# EasyEDA Pro project ProPrj_人体健康检测系统_2026-04-15.epro

# Schematic Schematic1
Assembly Variant: Basic; Board Name: Board1; Create Date: 2026-04-11; Page Name: P1; Project Name: 人体健康检测系统; Schematic Name: Schematic1; Update Date: 2026-04-11; BladeWidth: 10; Company: 嘉立创EDA; Page Size: A4; RegionStart: 1; ShowBorder: 1; TitleBlock: 1; TitleBlockPosition: 3; Version: V1.0; XRegionCount: 6; YRegionCount: 4
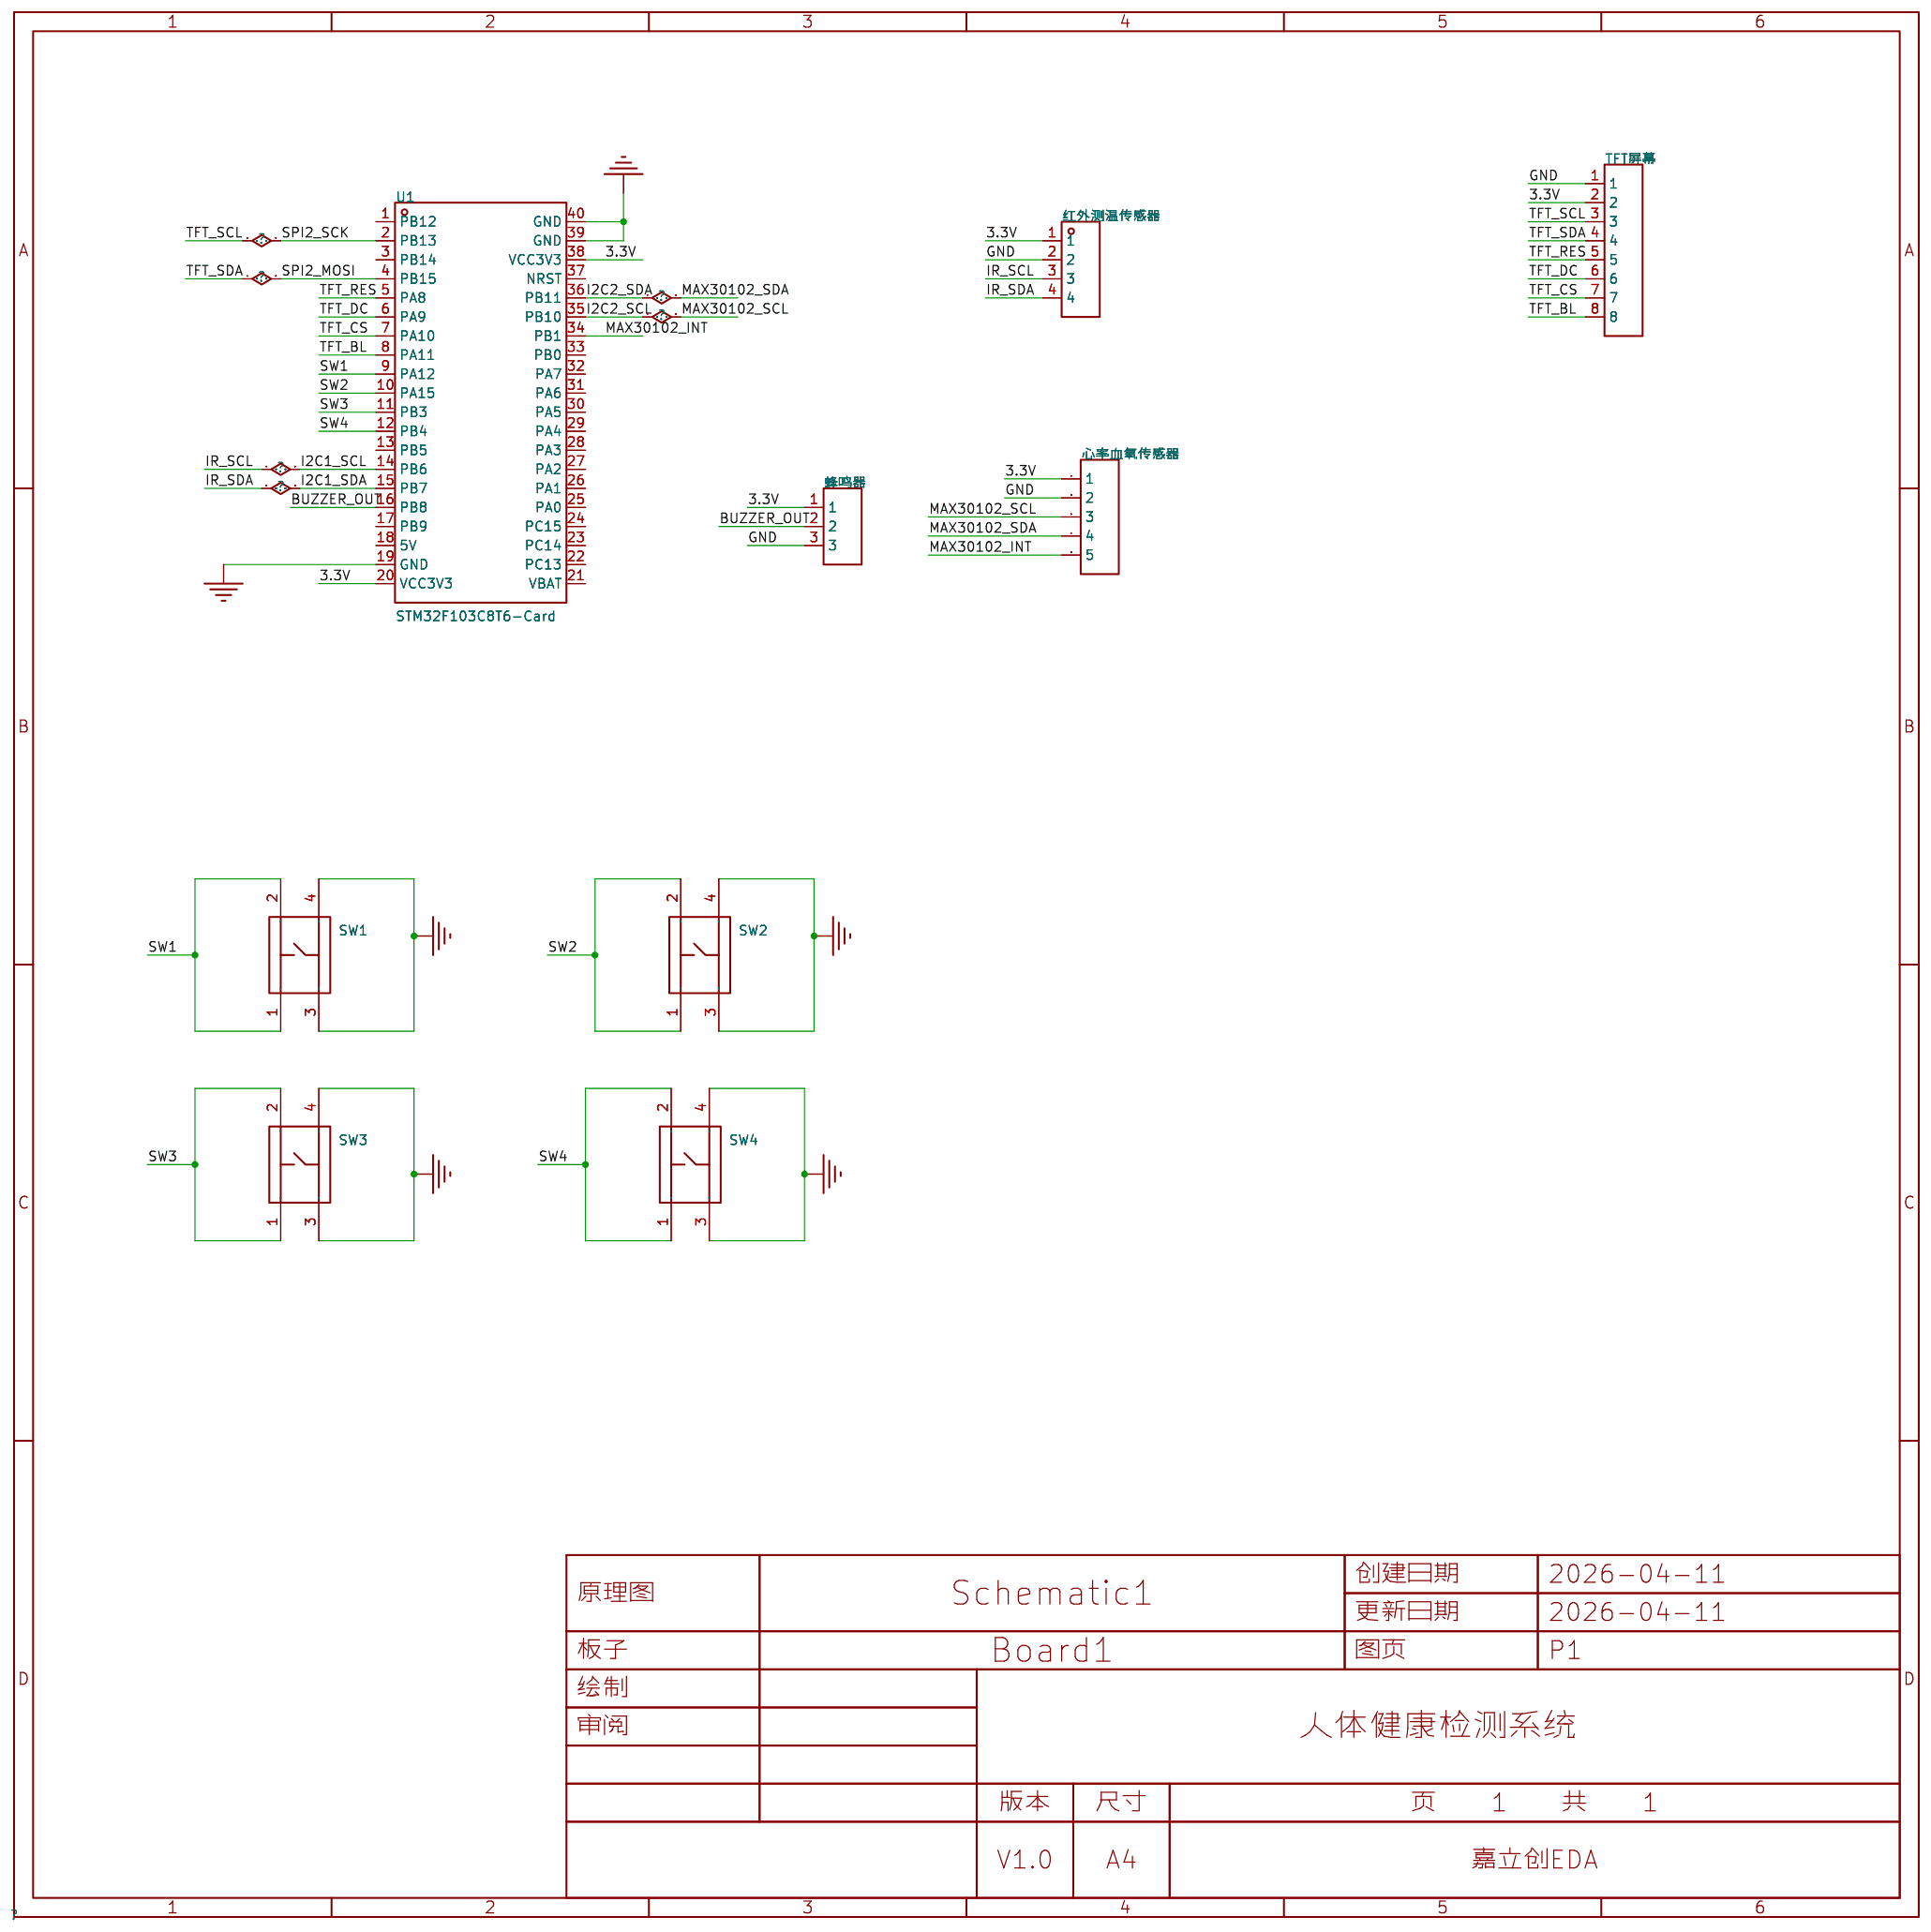
[diagram p0: schematic sheet]

## Parts
SW1  K2-1102DP-C4SW-04  [KEY-TH_4P-L6.0-W6.0-P4.50-LS6.50]
SW2  K2-1102DP-C4SW-04  [KEY-TH_4P-L6.0-W6.0-P4.50-LS6.50]
SW3  K2-1102DP-C4SW-04  [KEY-TH_4P-L6.0-W6.0-P4.50-LS6.50]
SW4  K2-1102DP-C4SW-04  [KEY-TH_4P-L6.0-W6.0-P4.50-LS6.50]
TFT屏幕  -  [HDR-TH_8P-P2.54-V-F-1]
U1  STM32F103C8T6-Card  [CONN-TH_L53.3-W22.9_STM32F103C8T6-CARD]
心率血氧传感器  -  [HDR-TH_5P-P2.54-V-F]
红外测温传感器  -  [HDR-TH_4P-P2.54-V-F]
蜂鸣器  -  [HDR-TH_3P-P2.54-V-F]

## Library data of the parts
SW1-SW4 = K2-1102DP-C4SW-04: 电路结构:单刀单掷;按钮形状:圆形按钮;作用力:2.5N;安装方式:直插;开关长度:6mm;开关宽度:6mm;开关高度:5mm;触点电流:50mA;额定电压:12V;带灯:-;工作寿命:10万次;; LCSC Part Name: 轻触按键开关6*6*5; Supplier Part: C110153; Manufacturer: 韩国韩荣; Supplier Footprint: 插件-4P,6x6mm; JLCPCB Part Class: Extended Part; Datasheet: https://item.szlcsc.com/datasheet/K2-1102DP-C4SW-04/111374.html; Supplier: LCSC; Circuit: 单刀单掷; Actuator Style: 圆形按钮; Operating Force: 2.5N; Mounting Type: 直插; Length: 6mm; Width: 6mm; Switch Height: 5mm; Contact Current: 50mA; Voltage Rating: 12V; Life: 10万次; Operating Temperature: -25℃~+85℃
TFT屏幕 = HDR-F_2.54_1x8P: Supplier Part: C27438; Supplier Footprint: 插件
U1 = STM32F103C8T6-Card: Supplier Part: C9900077949; Supplier Footprint: 插件; JLCPCB Part Class: Extended Part; Supplier: LCSC
心率血氧传感器 = HDR-F_2.54_1x5P: Supplier Part: C50950; Supplier Footprint: 插件
红外测温传感器 = HDR-F_2.54_1x4P: Supplier Part: C2718488; Supplier Footprint: 插件
蜂鸣器 = HDR-F_2.54_1x3P: Supplier Part: C541850; Supplier Footprint: 插件

## Nets
3.3V: TFT屏幕.2 U1.20(VCC3V3) U1.38(VCC3V3) 心率血氧传感器.1 红外测温传感器.1 蜂鸣器.1
GND: SW1.3 SW1.4 SW2.3 SW2.4 SW3.3 SW3.4 SW4.3 SW4.4 TFT屏幕.1 U1.19(GND) U1.39(GND) U1.40(GND) 心率血氧传感器.2 红外测温传感器.2 蜂鸣器.3
BUZZER_OUT: U1.16(PB8) 蜂鸣器.2
I2C1_SCL: U1.14(PB6) 红外测温传感器.3
I2C1_SDA: U1.15(PB7) 红外测温传感器.4
I2C2_SCL: U1.35(PB10) 心率血氧传感器.3
I2C2_SDA: U1.36(PB11) 心率血氧传感器.4
MAX30102_INT: U1.34(PB1) 心率血氧传感器.5
SPI2_MOSI: TFT屏幕.4 U1.4(PB15)
SPI2_SCK: TFT屏幕.3 U1.2(PB13)
SW1: SW1.1 SW1.2 U1.9(PA12)
SW2: SW2.1 SW2.2 U1.10(PA15)
SW3: SW3.1 SW3.2 U1.11(PB3)
SW4: SW4.1 SW4.2 U1.12(PB4)
TFT_BL: TFT屏幕.8 U1.8(PA11)
TFT_CS: TFT屏幕.7 U1.7(PA10)
TFT_DC: TFT屏幕.6 U1.6(PA9)
TFT_RES: TFT屏幕.5 U1.5(PA8)

Not connected (* = marked no-connect by the designer): U1 1(PB12) 3(PB14) 13(PB5) 17(PB9) 18(5V) 21(VBAT) 22(PC13) 23(PC14) 24(PC15) 25(PA0) 26(PA1) 27(PA2) 28(PA3) 29(PA4) 30(PA5) 31(PA6) 32(PA7) 33(PB0) 37(NRST)

# Board PCB1
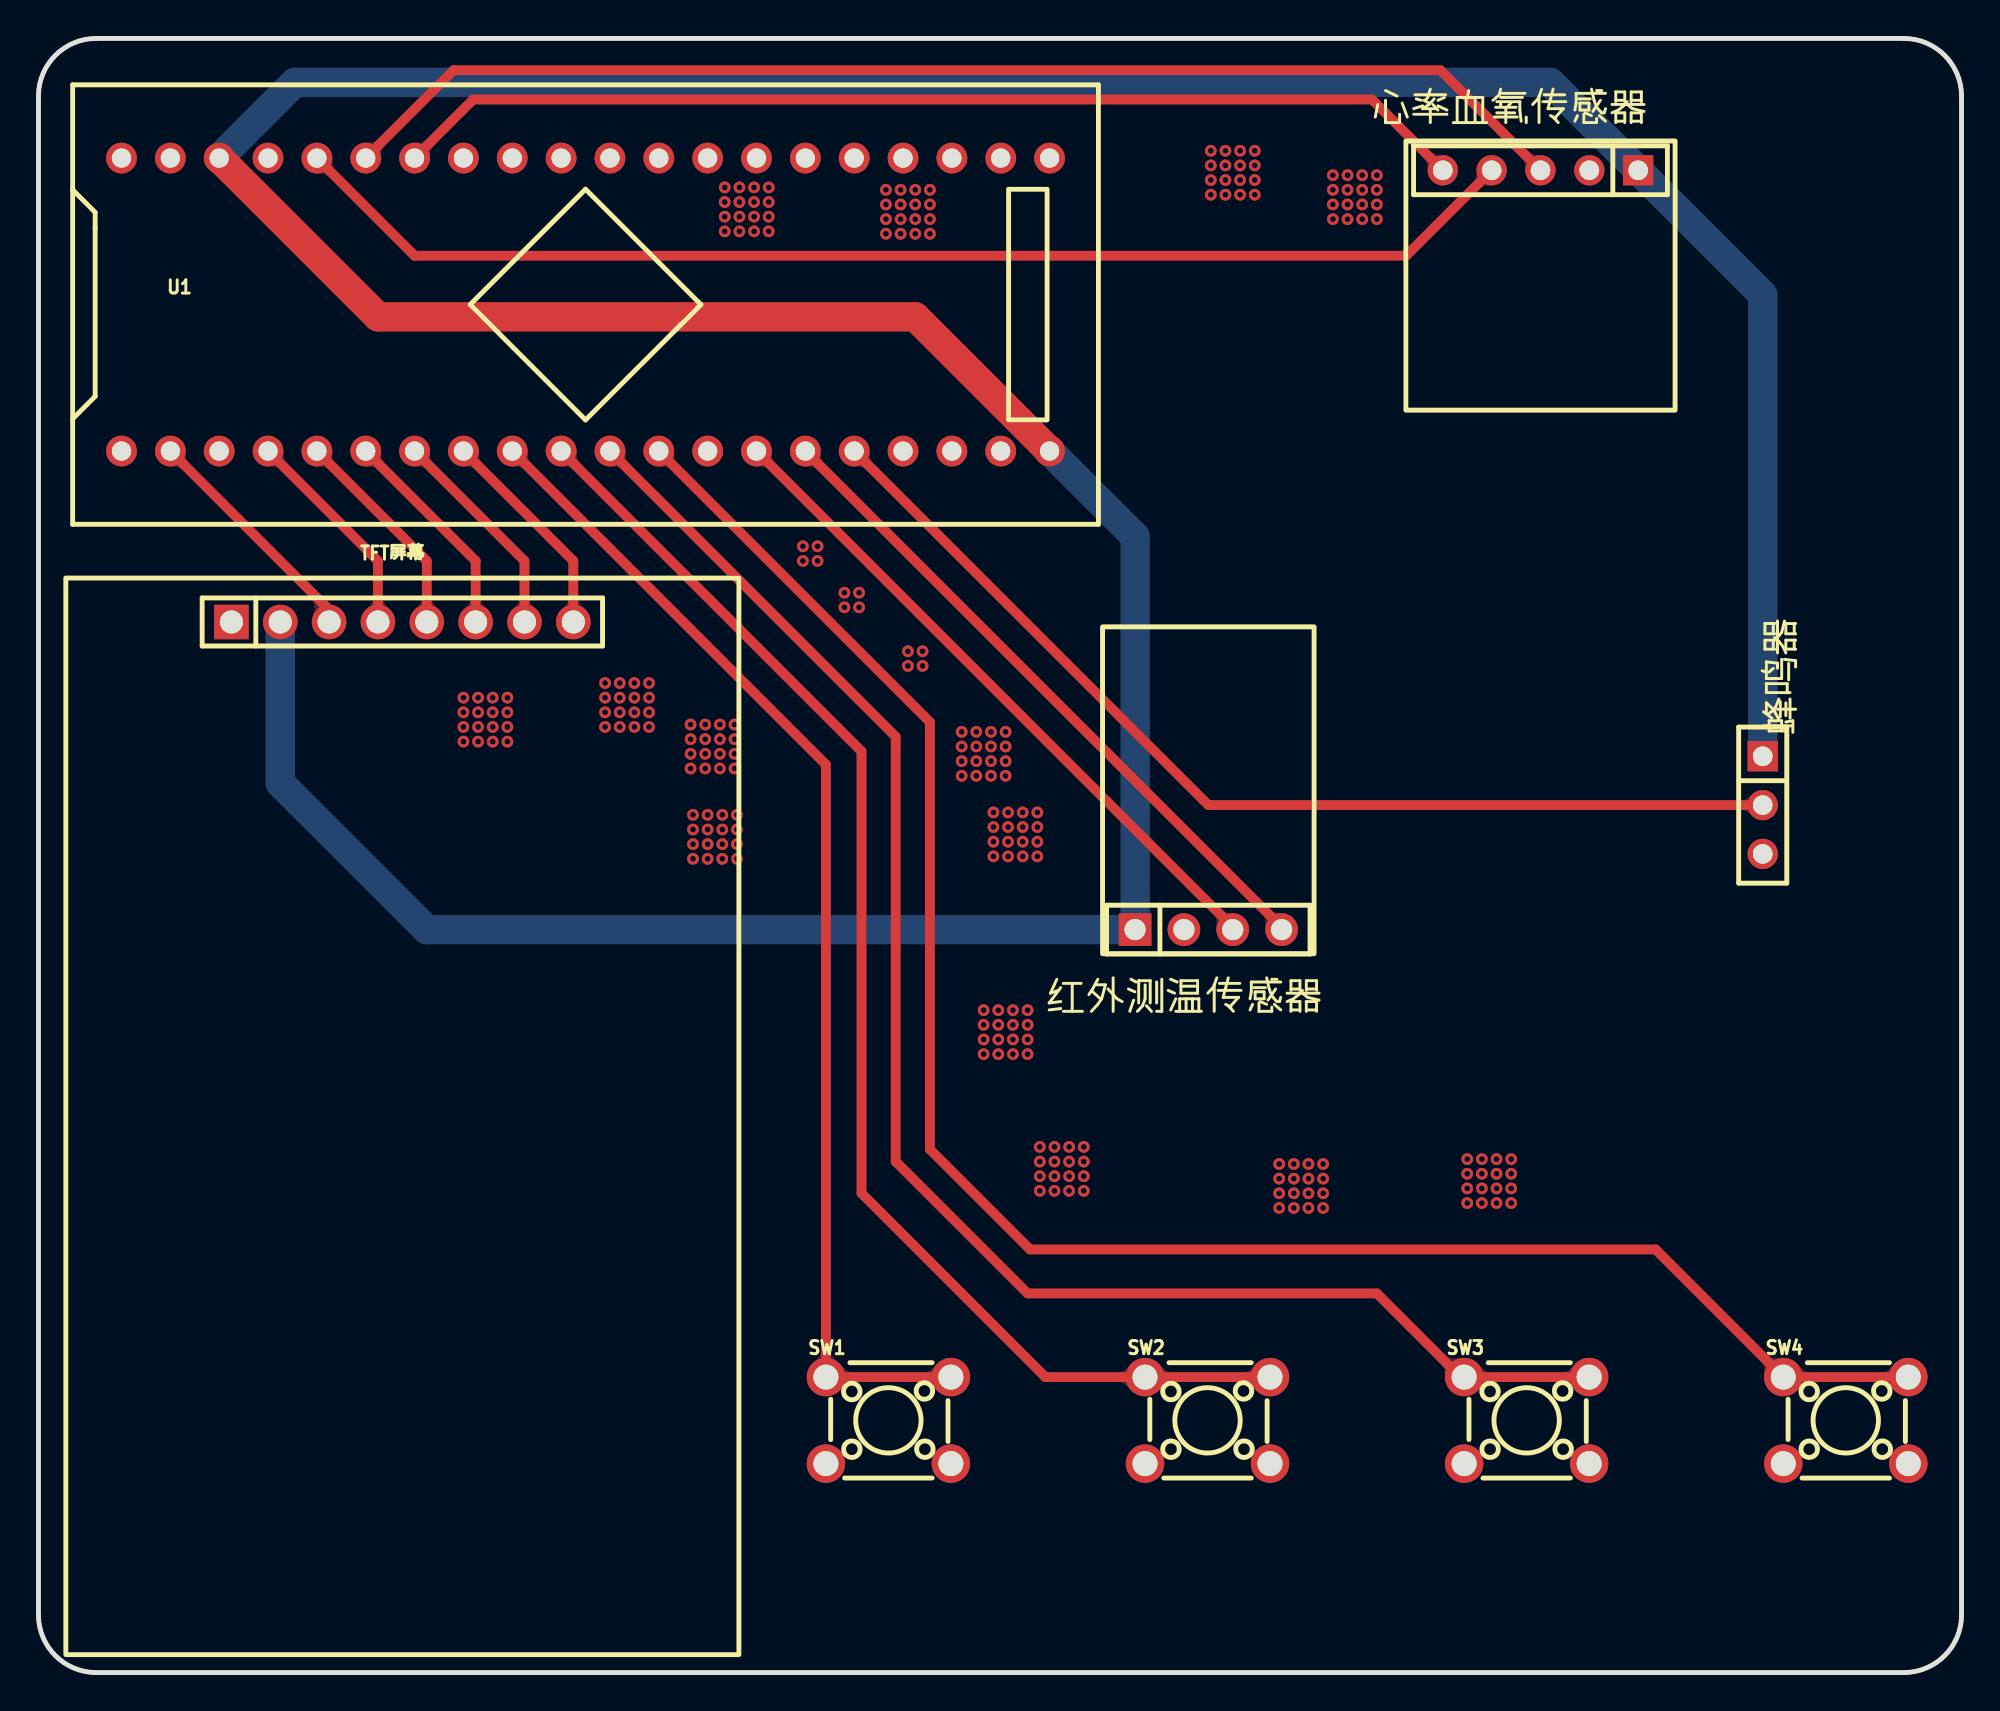
[diagram p1: board, top side]
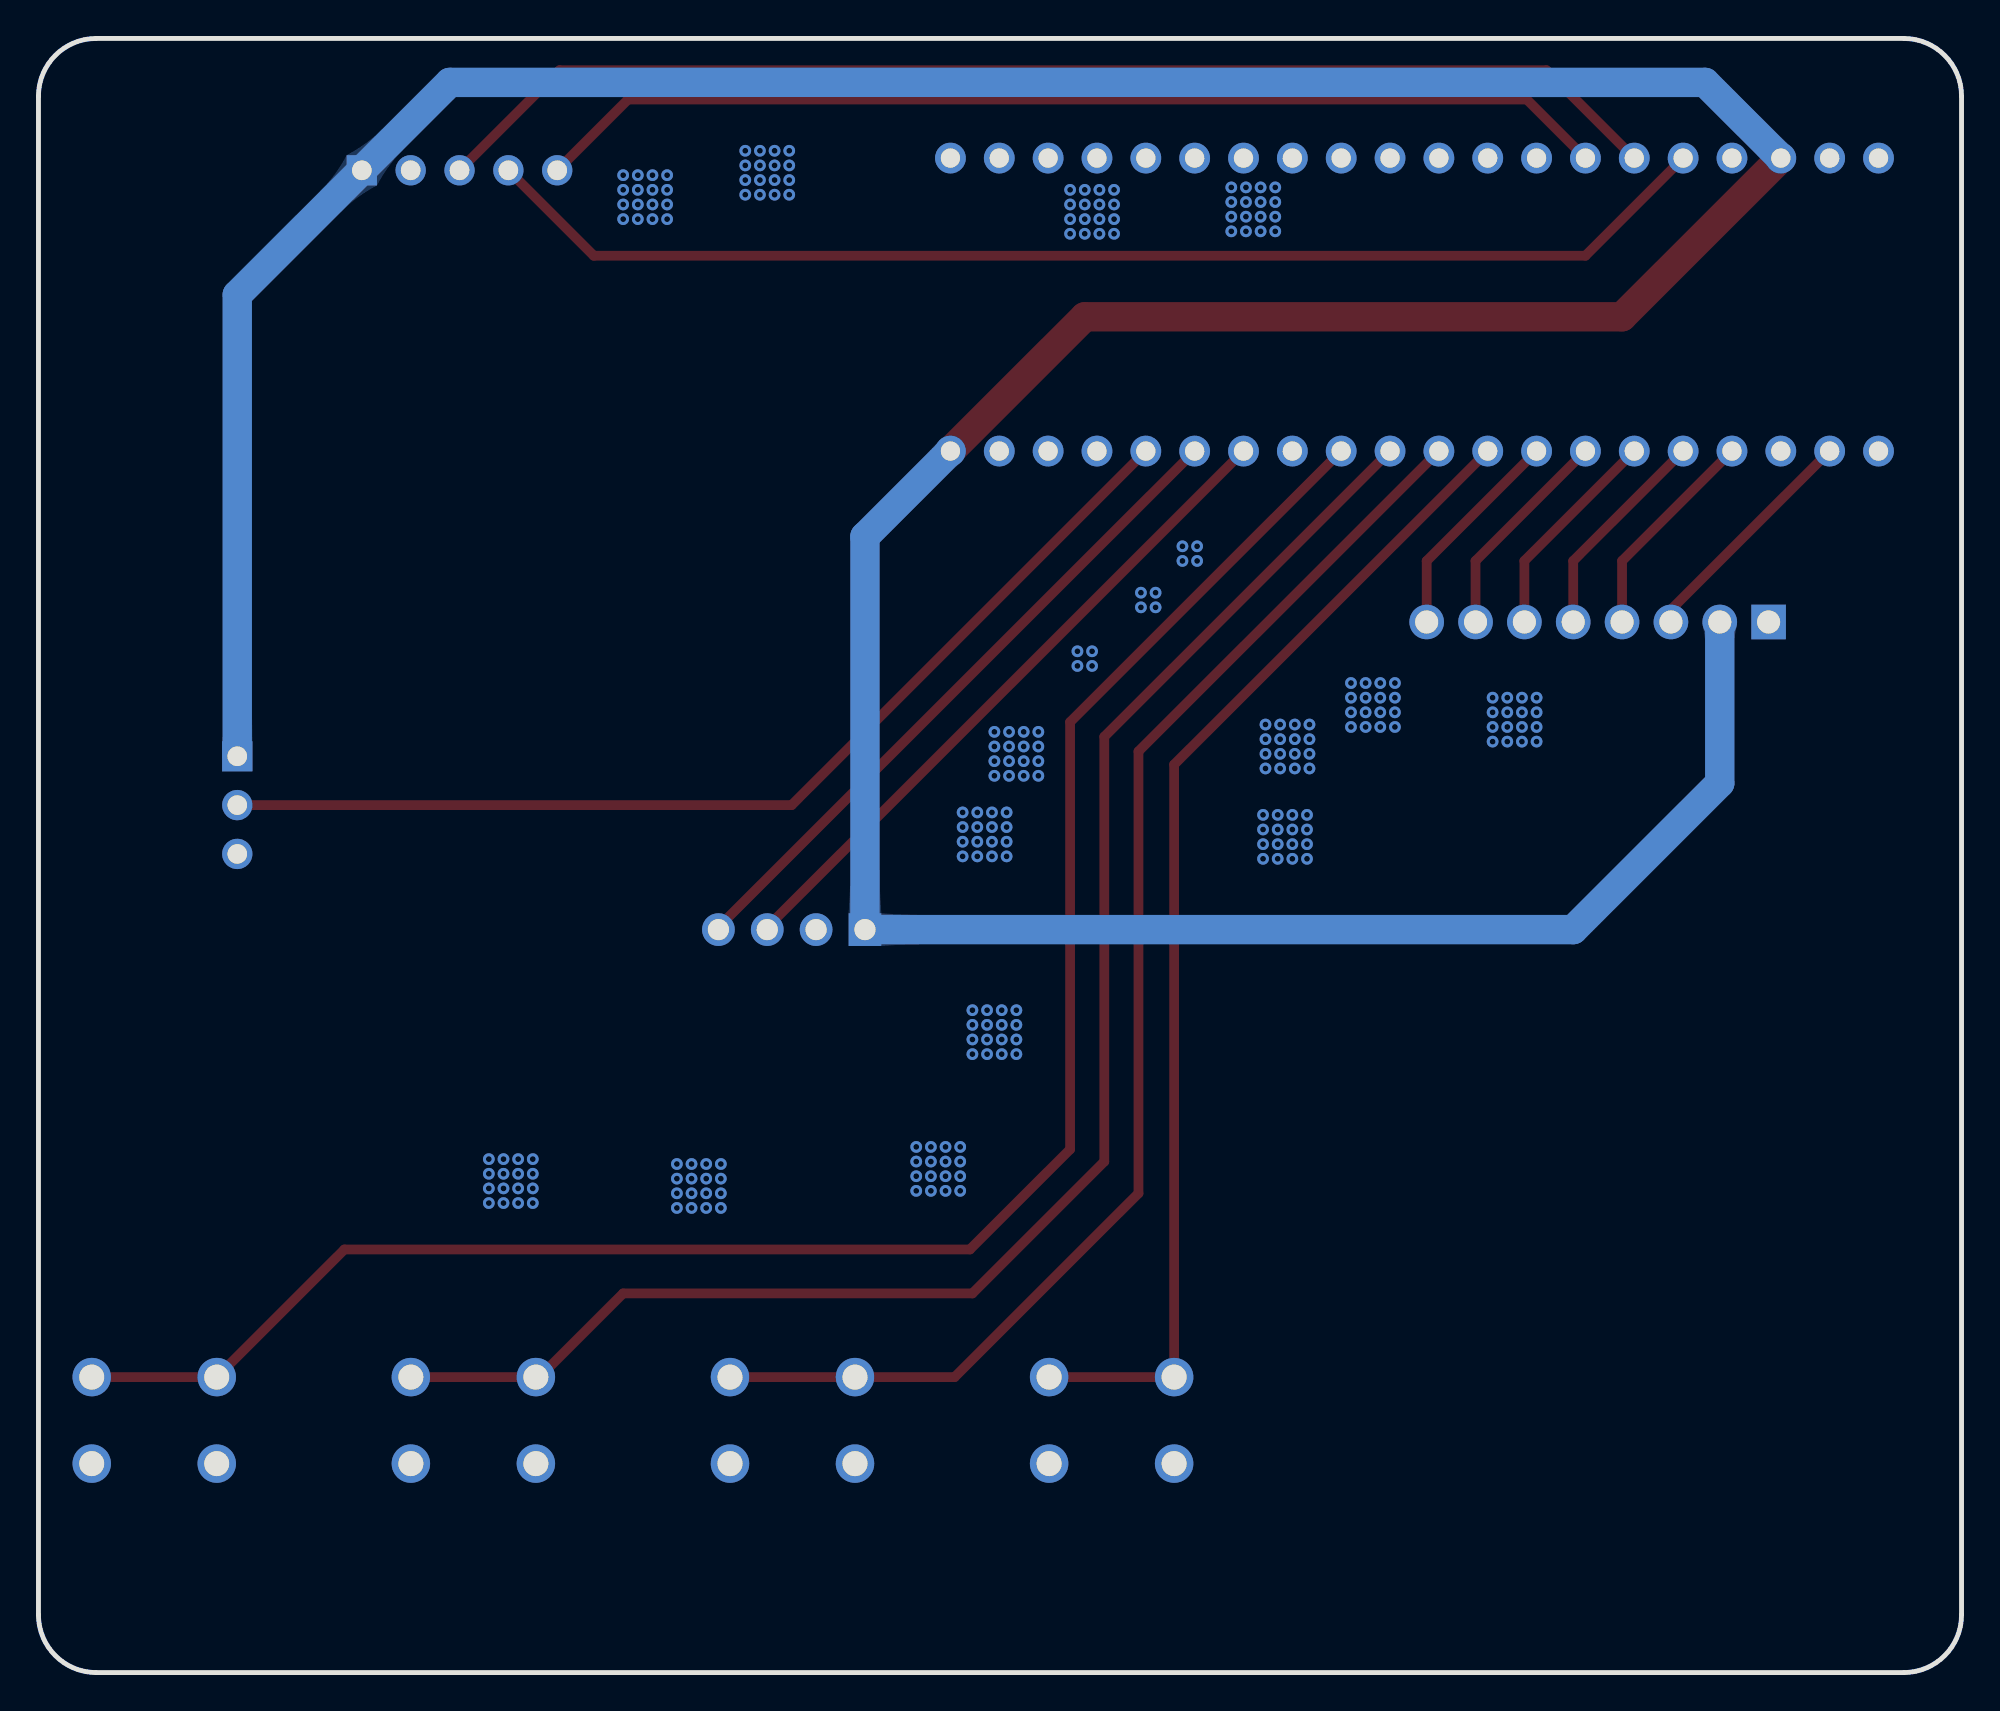
[diagram p2: board, bottom side, seen from below]

Outline 100 x 85 mm; copper layers: Top Layer, Bottom Layer. Coordinates in mm from the lower left corner of the outline.
Outline path: 0,82 0,3 arc(0.88,0.88) 3,0 97,0 arc(99.12,0.88) 100,3 100,82 arc(99.12,84.12) 97,85 3,85 arc(0.88,84.12) 0,82
Stack: Top Layer 0.035mm / Dielectric1 1.51mm FR4 er 4.5 / Bottom Layer 0.035mm

## Design rules (mm)
spacing copperThickness1oz (default): track to track 0.102, other pairs 0.152 to 0.3
spacing copperThickness2oz: track to track 0.203, other pairs 0.152 to 0.3
track width copperThickness1oz (default): min 0.127, default 0.254, max 2.54
track width copperThickness2oz: min 0.203, default 0.254, max 2.54
differential pair differentialPair (default): width min 0.127, default 0.254, max 2.54; gap min 0.152, default 0.152
net GND uses copperRegion

## Placement (name value [footprint] x y rotation side)
SW1  K2-1102DP-C4SW-04  [KEY-TH_4P-L6.0-W6.0-P4.50-LS6.50]  44.2 13.12 0 top
SW2  K2-1102DP-C4SW-04  [KEY-TH_4P-L6.0-W6.0-P4.50-LS6.50]  60.79 13.12 0 top
SW3  K2-1102DP-C4SW-04  [KEY-TH_4P-L6.0-W6.0-P4.50-LS6.50]  77.39 13.12 0 top
SW4  K2-1102DP-C4SW-04  [KEY-TH_4P-L6.0-W6.0-P4.50-LS6.50]  93.98 13.12 0 top
TFT屏幕  -  [HDR-TH_8P-P2.54-V-F-1]  18.92 54.65 0 top
U1  STM32F103C8T6-Card  [CONN-TH_L53.3-W22.9_STM32F103C8T6-CARD]  28.45 71.16 0 top
心率血氧传感器  -  [HDR-TH_5P-P2.54-V-F]  78.1 78.14 180 top
红外测温传感器  -  [HDR-TH_4P-P2.54-V-F]  60.83 38.64 0 top
蜂鸣器  -  [HDR-TH_3P-P2.54-V-F]  89.66 45.12 270 top

## Footprints (pads in the part's own frame, mm; a bottom-side part is the same pattern mirrored in y, then rotated)
CONN-TH_L53.3-W22.9_STM32F103C8T6-CARD
  round 1.6 hole 1: 1(-24.13,-7.62) 2(-21.59,-7.62) 3(-19.05,-7.62) 4(-16.51,-7.62) 5(-13.97,-7.62) 6(-11.43,-7.62) 7(-8.89,-7.62) 8(-6.35,-7.62) 9(-3.81,-7.62) 10(-1.27,-7.62) 11(1.27,-7.62) 12(3.81,-7.62) 13(6.35,-7.62) 14(8.89,-7.62) 15(11.43,-7.62) 16(13.97,-7.62) 17(16.51,-7.62) 18(19.05,-7.62) 19(21.59,-7.62) 20(24.13,-7.62) 21(24.13,7.62) 22(21.59,7.62) 23(19.05,7.62) 24(16.51,7.62) 25(13.97,7.62) 26(11.43,7.62) 27(8.89,7.62) 28(6.35,7.62) 29(3.81,7.62) 30(1.27,7.62) 31(-1.27,7.62) 32(-3.81,7.62) 33(-6.35,7.62) 34(-8.89,7.62) 35(-11.43,7.62) 36(-13.97,7.62) 37(-16.51,7.62) 38(-19.05,7.62) 39(-21.59,7.62) 40(-24.13,7.62)
HDR-TH_3P-P2.54-V-F
  rect 1.575x1.575 hole 1.02: 1(-2.54,0)
  round 1.575 hole 1.02: 2(0,0) 3(2.54,0)
HDR-TH_4P-P2.54-V-F
  rect 1.7x1.7 hole 1.1: 1(-3.81,0)
  round 1.7 hole 1.1: 2(-1.27,0) 3(1.27,0) 4(3.81,0)
HDR-TH_5P-P2.54-V-F
  rect 1.575x1.575 hole 1.02: 1(-5.08,0)
  round 1.575 hole 1.02: 2(-2.54,0) 3(0,0) 4(2.54,0) 5(5.08,0)
HDR-TH_8P-P2.54-V-F-1
  rect 1.8x1.8 hole 1.2: 1(-8.89,0)
  round 1.8 hole 1.2: 2(-6.35,0) 3(-3.81,0) 4(-1.27,0) 5(1.27,0) 6(3.81,0) 7(6.35,0) 8(8.89,0)
KEY-TH_4P-L6.0-W6.0-P4.50-LS6.50
  round 2 hole 1.3: 1(-3.25,2.25) 2(3.25,2.25) 3(-3.25,-2.25) 4(3.25,-2.25)

## Nets
As in the schematic, except:
GND: SW1.3 SW1.4 SW2.3 SW2.4 SW3.3 SW3.4 SW4.3 SW4.4 TFT屏幕.1 心率血氧传感器.2 红外测温传感器.2 蜂鸣器.3

Pads without a net: U1 1 3 13 17 18 19 21 22 23 24 25 26 27 28 29 30 31 32 33 37 39 40

## Via types
v1: diameter 0.61, hole 0.305, Top Layer to Bottom Layer, 236 vias

## Routing (per net, layer and track width the routed paths; a pad name or vN(x,y) marks a point on that pad's centre or on a via; arc(x,y) is an arc through that point)
3.3V: length 242.7
  Top Layer w1.524: U1.38 17.65,70.52 45.59,70.52 U1.20
  Bottom Layer w1.524: 蜂鸣器.1 89.66,71.67 心率血氧传感器.1 78.61,82.71 13.33,82.71 U1.38 ; 12.57,54.65 12.57,46.27 20.19,38.64 红外测温传感器.1 57.02,59.09 U1.20
GND:
  vias: v1(22.1,50.71) v1(22.1,49.95) v1(22.1,49.19) v1(22.1,48.42) v1(22.86,50.71) v1(22.86,49.95) v1(22.86,49.19) v1(22.86,48.42) v1(23.62,50.71) v1(23.62,49.95) v1(23.62,49.19) v1(23.62,48.42) v1(24.38,50.71) v1(24.38,49.95) v1(24.38,49.19) v1(24.38,48.42) v1(29.46,51.47) v1(29.46,50.71) v1(29.46,49.95) v1(29.46,49.19) v1(30.23,51.47) v1(30.23,50.71) v1(30.23,49.95) v1(30.23,49.19) v1(30.99,51.47) v1(30.99,50.71) v1(30.99,49.95) v1(30.99,49.19) v1(31.75,51.47) v1(31.75,50.71) v1(31.75,49.95) v1(31.75,49.19) v1(33.91,49.31) v1(33.91,48.55) v1(33.91,47.79) v1(33.91,47.03) v1(34.04,44.61) v1(34.04,43.85) v1(34.04,43.09) v1(34.04,42.33) v1(34.67,49.31) v1(34.67,48.55) v1(34.67,47.79) v1(34.67,47.03) v1(34.8,44.61) v1(34.8,43.85) v1(34.8,43.09) v1(34.8,42.33) v1(35.43,49.31) v1(35.43,48.55) v1(35.43,47.79) v1(35.43,47.03) v1(35.56,44.61) v1(35.56,43.85) v1(35.56,43.09) v1(35.56,42.33) v1(35.69,77.25) v1(35.69,76.49) v1(35.69,75.73) v1(35.69,74.97) v1(36.19,49.31) v1(36.19,48.55) v1(36.19,47.79) v1(36.19,47.03) v1(36.32,44.61) v1(36.32,43.85) v1(36.32,43.09) v1(36.32,42.33) v1(36.45,77.25) v1(36.45,76.49) v1(36.45,75.73) v1(36.45,74.97) v1(37.21,77.25) v1(37.21,76.49) v1(37.21,75.73) v1(37.21,74.97) v1(37.97,77.25) v1(37.97,76.49) v1(37.97,75.73) v1(37.97,74.97) v1(39.75,58.58) v1(39.75,57.82) v1(40.51,58.58) v1(40.51,57.82) v1(41.91,56.17) v1(41.91,55.41) v1(42.67,56.17) v1(42.67,55.41) v1(44.07,77.13) v1(44.07,76.36) v1(44.07,75.6) v1(44.07,74.84) v1(44.83,77.13) v1(44.83,76.36) v1(44.83,75.6) v1(44.83,74.84) v1(45.21,53.12) v1(45.21,52.36) v1(45.59,77.13) v1(45.59,76.36) v1(45.59,75.6) v1(45.59,74.84) v1(45.97,53.12) v1(45.97,52.36) v1(46.35,77.13) v1(46.35,76.36) v1(46.35,75.6) v1(46.35,74.84) v1(48.01,48.93) v1(48.01,48.17) v1(48.01,47.41) v1(48.01,46.65) v1(48.77,48.93) v1(48.77,48.17) v1(48.77,47.41) v1(48.77,46.65) v1(49.15,34.45) v1(49.15,33.69) v1(49.15,32.93) v1(49.15,32.17) v1(49.53,48.93) v1(49.53,48.17) v1(49.53,47.41) v1(49.53,46.65) v1(49.66,44.74) v1(49.66,43.98) v1(49.66,43.22) v1(49.66,42.45) v1(49.91,34.45) v1(49.91,33.69) v1(49.91,32.93) v1(49.91,32.17) v1(50.29,48.93) v1(50.29,48.17) v1(50.29,47.41) v1(50.29,46.65) v1(50.42,44.74) v1(50.42,43.98) v1(50.42,43.22) v1(50.42,42.45) v1(50.67,34.45) v1(50.67,33.69) v1(50.67,32.93) v1(50.67,32.17) v1(51.18,44.74) v1(51.18,43.98) v1(51.18,43.22) v1(51.18,42.45) v1(51.44,34.45) v1(51.44,33.69) v1(51.44,32.93) v1(51.44,32.17) v1(51.94,44.74) v1(51.94,43.98) v1(51.94,43.22) v1(51.94,42.45) v1(52.07,27.34) v1(52.07,26.58) v1(52.07,25.82) v1(52.07,25.06) v1(52.83,27.34) v1(52.83,26.58) v1(52.83,25.82) v1(52.83,25.06) v1(53.59,27.34) v1(53.59,26.58) v1(53.59,25.82) v1(53.59,25.06) v1(54.36,27.34) v1(54.36,26.58) v1(54.36,25.82) v1(54.36,25.06) v1(60.96,79.16) v1(60.96,78.4) v1(60.96,77.63) v1(60.96,76.87) v1(61.72,79.16) v1(61.72,78.4) v1(61.72,77.63) v1(61.72,76.87) v1(62.48,79.16) v1(62.48,78.4) v1(62.48,77.63) v1(62.48,76.87) v1(63.25,79.16) v1(63.25,78.4) v1(63.25,77.63) v1(63.25,76.87) v1(64.52,26.45) v1(64.52,25.69) v1(64.52,24.93) v1(64.52,24.17) v1(65.28,26.45) v1(65.28,25.69) v1(65.28,24.93) v1(65.28,24.17) v1(66.04,26.45) v1(66.04,25.69) v1(66.04,24.93) v1(66.04,24.17) v1(66.8,26.45) v1(66.8,25.69) v1(66.8,24.93) v1(66.8,24.17) v1(67.31,77.89) v1(67.31,77.13) v1(67.31,76.36) v1(67.31,75.6) v1(68.07,77.89) v1(68.07,77.13) v1(68.07,76.36) v1(68.07,75.6) v1(68.83,77.89) v1(68.83,77.13) v1(68.83,76.36) v1(68.83,75.6) v1(69.6,77.89) v1(69.6,77.13) v1(69.6,76.36) v1(69.6,75.6) v1(74.29,26.71) v1(74.29,25.94) v1(74.29,25.18) v1(74.29,24.42) v1(75.06,26.71) v1(75.06,25.94) v1(75.06,25.18) v1(75.06,24.42) v1(75.82,26.71) v1(75.82,25.94) v1(75.82,25.18) v1(75.82,24.42) v1(76.58,26.71) v1(76.58,25.94) v1(76.58,25.18) v1(76.58,24.42)
BUZZER_OUT: length 54.9
  Top Layer w0.508: U1.16 60.83,45.12 蜂鸣器.2
I2C1_SCL: length 35.1
  Top Layer w0.508: 红外测温传感器.3 62.1,38.77 U1.14
I2C1_SDA: length 35.1
  Top Layer w0.508: 红外测温传感器.4 64.64,38.77 U1.15
I2C2_SCL: length 65.1
  Top Layer w0.508: U1.35 21.59,83.35 72.9,83.35 心率血氧传感器.3
I2C2_SDA: length 65
  Top Layer w0.508: U1.36 19.56,73.7 71.12,73.7 心率血氧传感器.4
MAX30102_INT: length 56.3
  Top Layer w0.508: U1.34 22.61,81.83 69.34,81.83 心率血氧传感器.5
SPI2_MOSI: length 11.3
  Top Layer w0.508: TFT屏幕.4 17.65,57.82 U1.4
SPI2_SCK: length 12.3
  Top Layer w0.508: TFT屏幕.3 15.11,55.28 U1.2
SW1: length 61.4
  Top Layer w0.508: U1.9 40.95,47.23 SW1.1 SW1.2
SW2: length 70.3
  Top Layer w0.508: U1.10 42.8,47.92 42.8,24.93 52.36,15.37 SW2.1 SW2.2
SW3: length 83.8
  Top Layer w0.508: SW3.2 SW3.1 73.95,15.37 69.6,19.72 51.44,19.72 44.58,26.58 44.58,48.68 U1.11
SW4: length 97.9
  Top Layer w0.508: SW4.2 SW4.1 84.09,22.01 51.56,22.01 46.35,27.22 46.35,49.44 U1.12
TFT_BL: length 11.3
  Top Layer w0.508: TFT屏幕.8 27.81,57.82 U1.8
TFT_CS: length 11.3
  Top Layer w0.508: U1.7 25.27,57.82 TFT屏幕.7
TFT_DC: length 11.3
  Top Layer w0.508: U1.6 22.73,57.82 TFT屏幕.6
TFT_RES: length 11.3
  Top Layer w0.508: TFT屏幕.5 20.19,57.82 U1.5

Small or netless copper shapes (teardrops, artwork), in the pictures only: 42 on Top Layer, 8 on Bottom Layer
